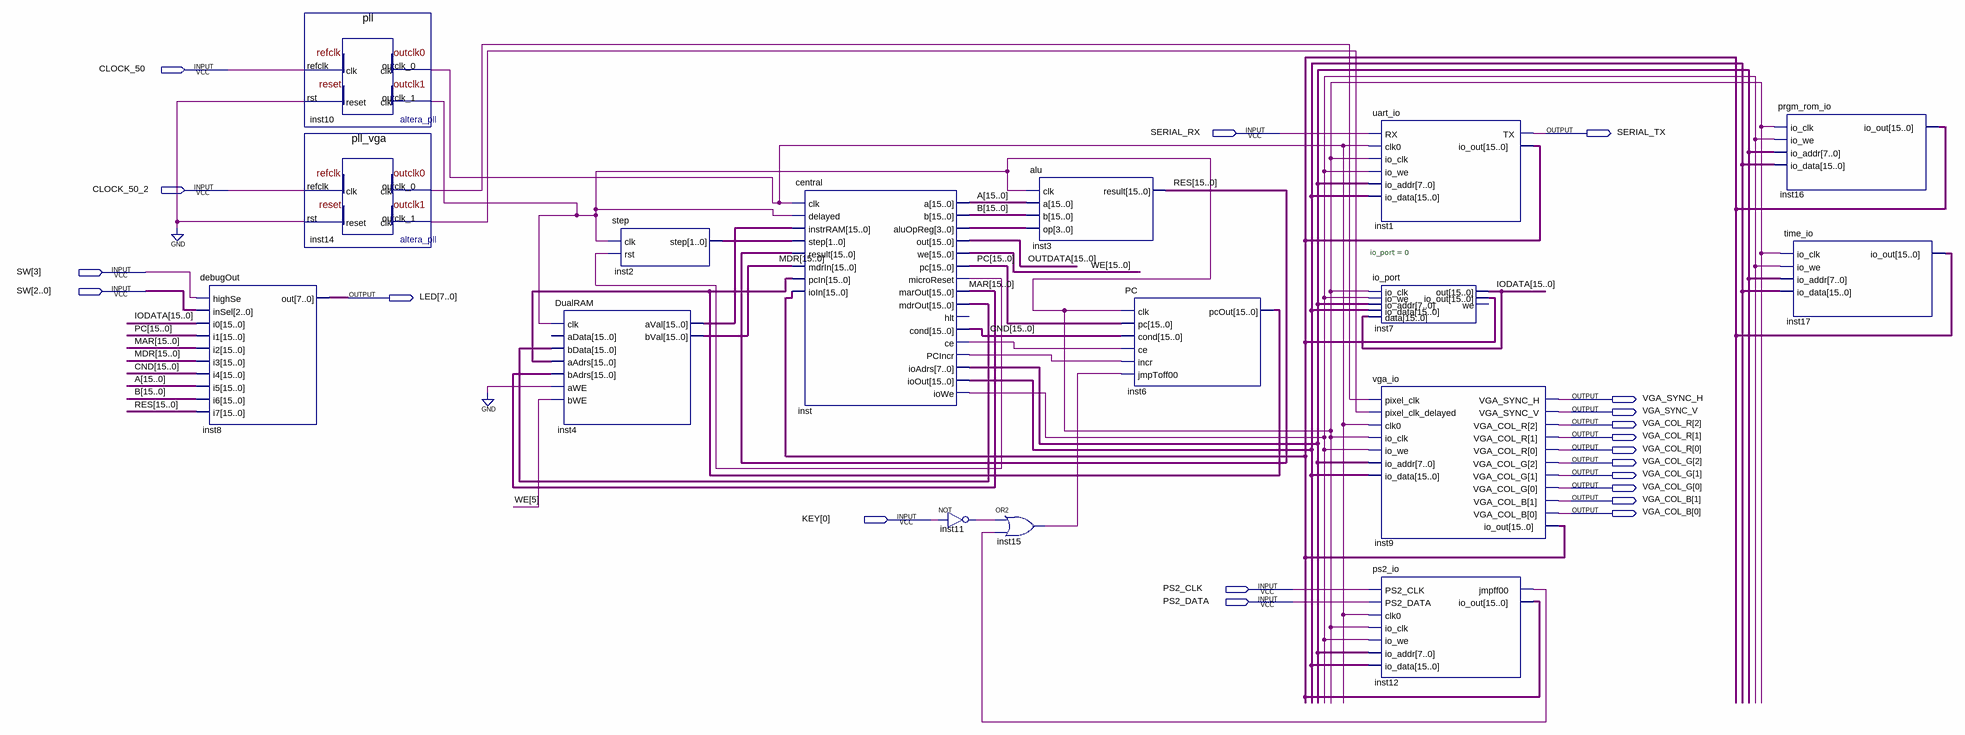
[diagram p0: schematic sheet]
// Quartus schematic comp16.bdf as structural Verilog: 16 symbols, 20 pins
module comp16 (
  input  CLOCK_50,
  input  SERIAL_RX,
  input  CLOCK_50_2,
  input  [3:0] SW,
  input  [0:0] KEY,
  input  PS2_CLK,
  input  PS2_DATA,
  output SERIAL_TX,
  output [7:0] LED,
  output VGA_SYNC_H,
  output VGA_SYNC_V,
  output [2:0] VGA_COL_R,
  output [2:0] VGA_COL_G,
  output [1:0] VGA_COL_B
);

  wire inst10_outclk_0, inst10_outclk_1, inst11_out, inst12_jmpff00, inst14_outclk_0, inst14_outclk_1,
       inst15_out, inst_ce, inst_iowe, inst_microreset, inst_pcincr;
  wire [1:0] inst2_step;
  wire [3:0] inst_aluopreg;
  wire [7:0] inst_ioadrs;
  wire [15:0] A, B, CND, inst1_io_out, inst4_aval, inst6_pcout, inst_ioout, inst_mdrout, IODATA, MAR, MDR,
       OUTDATA, PC, RES, WE;

  debugOut inst8 (
    .highSe(SW[3]), .inSel(SW[2:0]), .i0(IODATA), .i1(PC), .i2(MAR), .i3(MDR), .i4(CND), .i5(A), .i6(B),
    .i7(RES), .out(LED));
  pll inst10 (.refclk(CLOCK_50), .rst(1'b0), .outclk_0(inst10_outclk_0), .outclk_1(inst10_outclk_1));
  pll_vga inst14 (.refclk(CLOCK_50_2), .rst(1'b0), .outclk_0(inst14_outclk_0), .outclk_1(inst14_outclk_1));
  DualRAM inst4 (
    .clk(inst10_outclk_1), .bData(inst_mdrout), .aAdrs(inst6_pcout), .bAdrs(MAR), .aWE(1'b0), .bWE(WE[5]),
    .aVal(inst4_aval), .bVal(MDR));  // open: aData
  step inst2 (.clk(inst10_outclk_1), .rst(inst_microreset), .step(inst2_step));
  central inst (
    .clk(inst10_outclk_0), .delayed(inst10_outclk_1), .instrRAM(inst4_aval), .step(inst2_step), .result(RES),
    .mdrIn(MDR), .pcIn(inst6_pcout), .ioIn(inst1_io_out), .a(A), .b(B), .aluOpReg(inst_aluopreg),
    .out(OUTDATA), .we(WE), .pc(PC), .microReset(inst_microreset), .marOut(MAR), .mdrOut(inst_mdrout),
    .cond(CND), .ce(inst_ce), .PCIncr(inst_pcincr), .ioAdrs(inst_ioadrs), .ioOut(inst_ioout), .ioWe(inst_iowe));  // open: hlt
  not inst11 (inst11_out, KEY[0]);
  alu inst3 (.clk(inst10_outclk_1), .a(A), .b(B), .op(inst_aluopreg), .result(RES));
  or inst15 (inst15_out, inst11_out, inst12_jmpff00);
  PC inst6 (
    .clk(inst10_outclk_1), .pc(PC), .cond(CND), .ce(inst_ce), .incr(inst_pcincr), .jmpToff00(inst15_out),
    .pcOut(inst6_pcout));
  uart_io inst1 (
    .RX(SERIAL_RX), .clk0(inst10_outclk_0), .io_clk(inst10_outclk_1), .io_we(inst_iowe),
    .io_addr(inst_ioadrs), .io_data(inst_ioout), .TX(SERIAL_TX), .io_out(inst1_io_out));
  io_port #(.io_port(0)) inst7 (
    .io_clk(inst10_outclk_1), .io_we(inst_iowe), .io_addr(inst_ioadrs), .io_data(inst_ioout), .data(IODATA),
    .out(IODATA), .io_out(inst1_io_out));  // open: we
  vga_io inst9 (
    .pixel_clk(inst14_outclk_0), .pixel_clk_delayed(inst14_outclk_1), .clk0(inst10_outclk_0),
    .io_clk(inst10_outclk_1), .io_we(inst_iowe), .io_addr(inst_ioadrs), .io_data(inst_ioout),
    .VGA_SYNC_H(VGA_SYNC_H), .VGA_SYNC_V(VGA_SYNC_V), .VGA_COL_R(VGA_COL_R), .VGA_COL_G(VGA_COL_G),
    .VGA_COL_B(VGA_COL_B), .io_out(inst1_io_out));
  ps2_io inst12 (
    .PS2_CLK(PS2_CLK), .PS2_DATA(PS2_DATA), .clk0(inst10_outclk_0), .io_clk(inst10_outclk_1),
    .io_we(inst_iowe), .io_addr(inst_ioadrs), .io_data(inst_ioout), .jmpff00(inst12_jmpff00),
    .io_out(inst1_io_out));
  prgm_rom_io inst16 (
    .io_clk(inst10_outclk_1), .io_we(inst_iowe), .io_addr(inst_ioadrs), .io_data(inst_ioout),
    .io_out(inst1_io_out));
  time_io inst17 (
    .io_clk(inst10_outclk_1), .io_we(inst_iowe), .io_addr(inst_ioadrs), .io_data(inst_ioout),
    .io_out(inst1_io_out));
endmodule
